# Altium project Sensor.PrjPcb
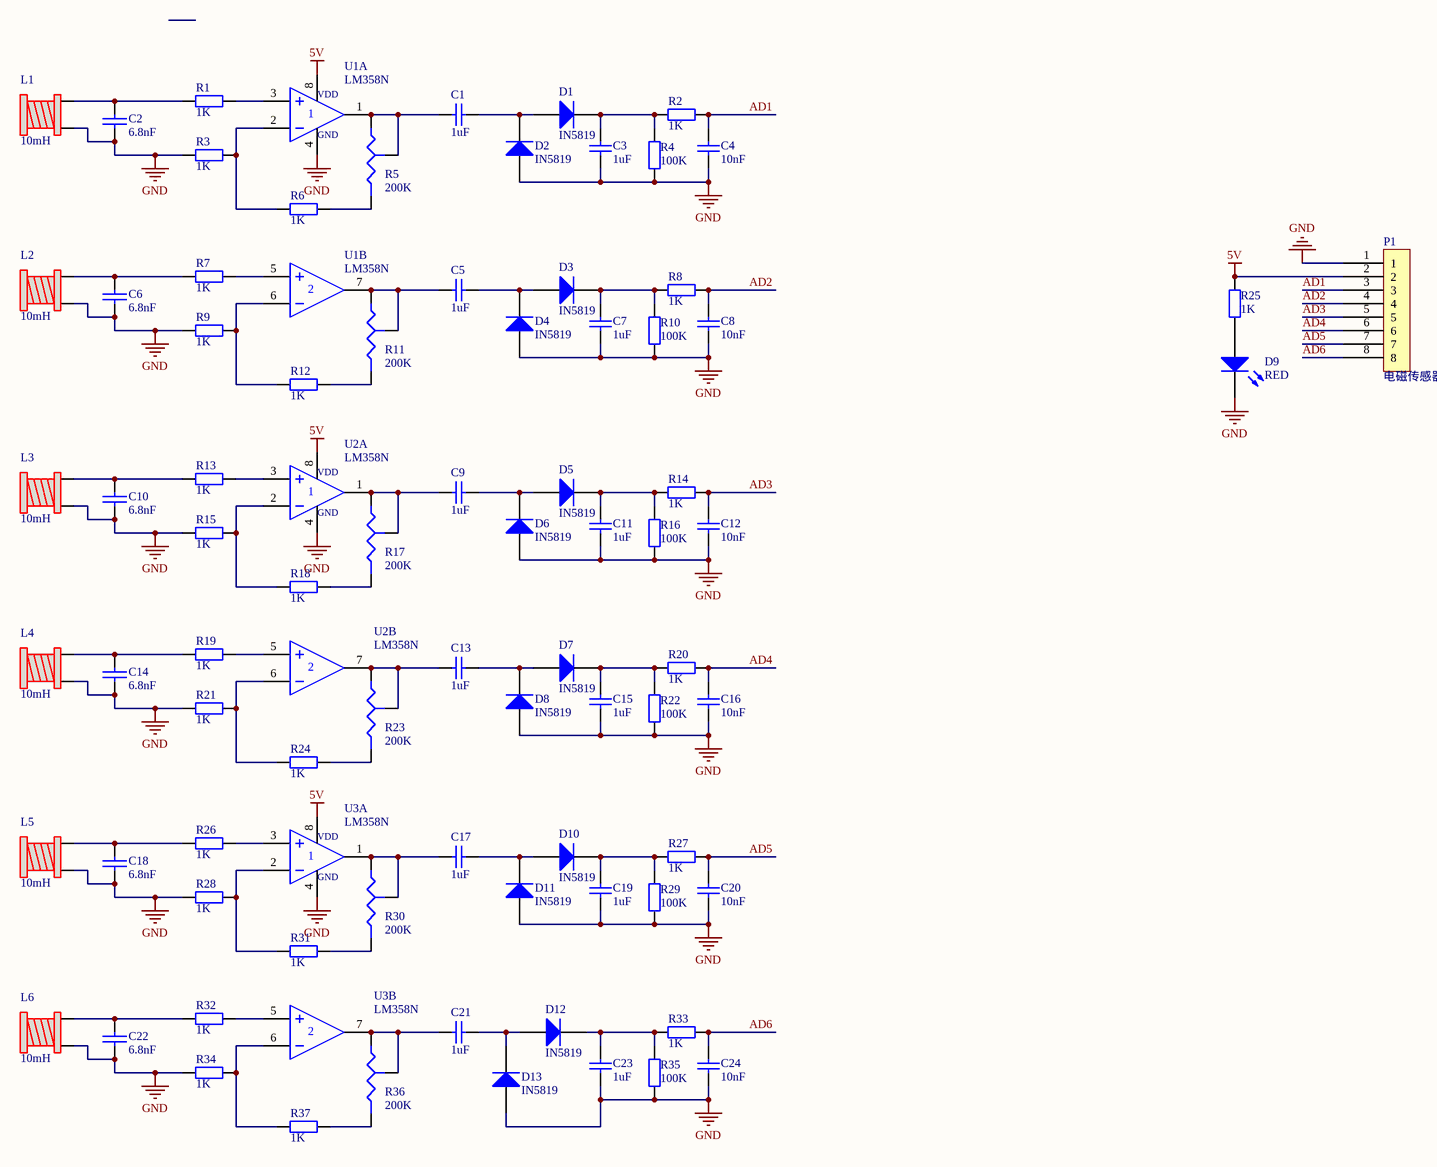
[diagram p0: Sensor.SchDoc]
1 sheet, 84 parts. Net scope: global (net labels, ports and power ports of the same name join across sheets).
Board file: Sensor.PcbDoc

## Sheet Sensor.SchDoc
size A3

### Parts
C1  1uF  [0603C]
C2  6.8nF  [0603C]
C3  1uF  [0603C]
C4  10nF  [0603C]
C5  1uF  [0603C]
C6  6.8nF  [0603C]
C7  1uF  [0603C]
C8  10nF  [0603C]
C9  1uF  [0603C]
C10  6.8nF  [0603C]
C11  1uF  [0603C]
C12  10nF  [0603C]
C13  1uF  [0603C]
C14  6.8nF  [0603C]
C15  1uF  [0603C]
C16  10nF  [0603C]
C17  1uF  [0603C]
C18  6.8nF  [0603C]
C19  1uF  [0603C]
C20  10nF  [0603C]
C21  1uF  [0603C]
C22  6.8nF  [0603C]
C23  1uF  [0603C]
C24  10nF  [0603C]
D1  IN5819  [DL-41 - duplicate]
D2  IN5819  [DL-41 - duplicate]
D3  IN5819  [DL-41 - duplicate]
D4  IN5819  [DL-41 - duplicate]
D5  IN5819  [DL-41 - duplicate]
D6  IN5819  [DL-41 - duplicate]
D7  IN5819  [DL-41 - duplicate]
D8  IN5819  [DL-41 - duplicate]
D9  RED  [0805LED]
D10  IN5819  [DL-41 - duplicate]
D11  IN5819  [DL-41 - duplicate]
D12  IN5819  [DL-41 - duplicate]
D13  IN5819  [DL-41 - duplicate]
L1  10mH  [6X8mm电感]
L2  10mH  [6X8mm电感]
L3  10mH  [6X8mm电感]
L4  10mH  [6X8mm电感]
L5  10mH  [6X8mm电感]
L6  10mH  [6X8mm电感]
P1  电磁传感器  [XH2.54_8P]
R1  value 1K  [0603-1]  (hidden comment: Res2)
R2  value 1K  [0603-1]  (hidden comment: Res2)
R3  value 1K  [0603-1]  (hidden comment: Res2)
R4  value 100K  [0603-1]  (hidden comment: Res2)
R5  200K  [VR_3362P]
R6  value 1K  [0603-1]  (hidden comment: Res2)
R7  value 1K  [0603-1]  (hidden comment: Res2)
R8  value 1K  [0603-1]  (hidden comment: Res2)
R9  value 1K  [0603-1]  (hidden comment: Res2)
R10  value 100K  [0603-1]  (hidden comment: Res2)
R11  200K  [VR_3362P]
R12  value 1K  [0603-1]  (hidden comment: Res2)
R13  value 1K  [0603-1]  (hidden comment: Res2)
R14  value 1K  [0603-1]  (hidden comment: Res2)
R15  value 1K  [0603-1]  (hidden comment: Res2)
R16  value 100K  [0603-1]  (hidden comment: Res2)
R17  200K  [VR_3362P]
R18  value 1K  [0603-1]  (hidden comment: Res2)
R19  value 1K  [0603-1]  (hidden comment: Res2)
R20  value 1K  [0603-1]  (hidden comment: Res2)
R21  value 1K  [0603-1]  (hidden comment: Res2)
R22  value 100K  [0603-1]  (hidden comment: Res2)
R23  200K  [VR_3362P]
R24  value 1K  [0603-1]  (hidden comment: Res2)
R25  value 1K  [0603-1]  (hidden comment: Res2)
R26  value 1K  [0603-1]  (hidden comment: Res2)
R27  value 1K  [0603-1]  (hidden comment: Res2)
R28  value 1K  [0603-1]  (hidden comment: Res2)
R29  value 100K  [0603-1]  (hidden comment: Res2)
R30  200K  [VR_3362P]
R31  value 1K  [0603-1]  (hidden comment: Res2)
R32  value 1K  [0603-1]  (hidden comment: Res2)
R33  value 1K  [0603-1]  (hidden comment: Res2)
R34  value 1K  [0603-1]  (hidden comment: Res2)
R35  value 100K  [0603-1]  (hidden comment: Res2)
R36  200K  [VR_3362P]
R37  value 1K  [0603-1]  (hidden comment: Res2)
U1  LM358N  [SOIC-8]  (parts A,B of 2)
U2  LM358N  [SOIC-8]  (parts A,B of 2)
U3  LM358N  [SOIC-8]  (parts A,B of 2)

### Nets
5V: P1.2 R25.1 U1.8(VDD) U2.8(VDD) U3.8(VDD)
GND: C2.2 C3.2 C4.2 C6.2 C7.2 C8.2 C10.2 C11.2 C12.2 C14.2 C15.2 C16.2 C18.2 C19.2 C20.2 C22.2 C23.2 C24.2 D2.1(A) D4.1(A) D6.1(A) D8.1(A) D9.2(K) D11.1(A) D13.1(A) L1.1 L2.1 L3.1 L4.1 L5.1 L6.1 P1.1 R3.1 R4.1 R9.1 R10.1 R15.1 R16.1 R21.1 R22.1 R28.1 R29.1 R34.1 R35.1 U1.4(GND) U2.4(GND) U3.4(GND)
AD1: C4.1 P1.3 R2.1
AD2: C8.1 P1.4 R8.1
AD3: C12.1 P1.5 R14.1
AD4: C16.1 P1.6 R20.1
AD5: C20.1 P1.7 R27.1
AD6: C24.1 P1.8 R33.1
NetC1_1: C1.1 D1.1(A) D2.2(K)
NetC1_2: C1.2 R5.1 R5.2 U1.1(OUT)
NetC2_1: C2.1 L1.2 R1.1
NetC3_1: C3.1 D1.2(K) R2.2 R4.2
NetC5_1: C5.1 D3.1(A) D4.2(K)
NetC5_2: C5.2 R11.1 R11.2 U1.7(OUT)
NetC6_1: C6.1 L2.2 R7.1
NetC7_1: C7.1 D3.2(K) R8.2 R10.2
NetC9_1: C9.1 D5.1(A) D6.2(K)
NetC9_2: C9.2 R17.1 R17.2 U2.1(OUT)
NetC10_1: C10.1 L3.2 R13.1
NetC11_1: C11.1 D5.2(K) R14.2 R16.2
NetC13_1: C13.1 D7.1(A) D8.2(K)
NetC13_2: C13.2 R23.1 R23.2 U2.7(OUT)
NetC14_1: C14.1 L4.2 R19.1
NetC15_1: C15.1 D7.2(K) R20.2 R22.2
NetC17_1: C17.1 D10.1(A) D11.2(K)
NetC17_2: C17.2 R30.1 R30.2 U3.1(OUT)
NetC18_1: C18.1 L5.2 R26.1
NetC19_1: C19.1 D10.2(K) R27.2 R29.2
NetC21_1: C21.1 D12.1(A) D13.2(K)
NetC21_2: C21.2 R36.1 R36.2 U3.7(OUT)
NetC22_1: C22.1 L6.2 R32.1
NetC23_1: C23.1 D12.2(K) R33.2 R35.2
NetD9_1: D9.1(A) R25.2
NetR1_2: R1.2 U1.3(IN+)
NetR3_2: R3.2 R6.1 U1.2(IN-)
NetR5_3: R5.3 R6.2
NetR7_2: R7.2 U1.5(IN+)
NetR9_2: R9.2 R12.1 U1.6(IN-)
NetR11_3: R11.3 R12.2
NetR13_2: R13.2 U2.3(IN+)
NetR15_2: R15.2 R18.1 U2.2(IN-)
NetR17_3: R17.3 R18.2
NetR19_2: R19.2 U2.5(IN+)
NetR21_2: R21.2 R24.1 U2.6(IN-)
NetR23_3: R23.3 R24.2
NetR26_2: R26.2 U3.3(IN+)
NetR28_2: R28.2 R31.1 U3.2(IN-)
NetR30_3: R30.3 R31.2
NetR32_2: R32.2 U3.5(IN+)
NetR34_2: R34.2 R37.1 U3.6(IN-)
NetR36_3: R36.3 R37.2

### Notes on the sheet
- Title
- Size:
- Date:
- A3
- Number:
- Time:
- Revision:
- Sheet
- of
- File:

### Library data of the parts
C1 C3-C5 C7-C9 C11-C13 C15-C17 C19-C21 C23 C24 = CAP
C2 C6 C10 C14 C18 C22 = 6.8μF: Capacitor
D1-D8 D10-D13 = Diode: Default Diode; PackageVersion: Sep-1996; PackageDescription: DO-214-AB/SMC; 2 C-Bend Leads; Body 7.9 x 5.9 mm, inc. leads (LxW); Code_JEDEC: DO-214-AB
D9 = LED2: Typical RED, GREEN, YELLOW, AMBER GaAs LED; Published: 8-Jun-2000; LatestRevisionDate: 17-Jul-2002; LatestRevisionNote: Re-released for DXP Platform.; PackageVersion: Feb-2002; PackageReference: 3.2X1.6X1.1; Publisher: Altium Limited; PackageDescription: SM LED; 2 Flat Leads
L1-L6 = Inductor_1
P1 = Header 8X1A: Header, 4-Pin, Dual row; LatestRevisionDate: 17-Jul-2002; LatestRevisionNote: Re-released for DXP Platform.; Publisher: Altium Limited
R1-R4 R6-R10 R12-R16 R18-R22 R24-R29 R31-R35 R37 = Res2: Resistor贴片封装; Published: 8-Jun-2000; Revision: July-2002: Re-released for DXP Platform.; Publisher: Altium Limited
R5 R11 R17 R23 R30 R36 = RES-ADJ
U1-U3 = LM358N: Dual Low-Power Operational Amplifier